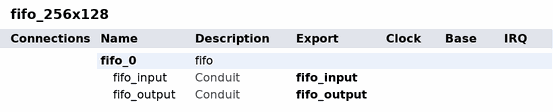
[diagram p0: system contents]
# Platform Designer (Qsys) system fifo_256x128, Arria 10 10AX115S2F45I1SG
# Parameters at their usual value, and those the tool derives, are not listed.
package require qsys
create_system fifo_256x128
set_project_property DEVICE_FAMILY {Arria 10}
set_project_property DEVICE 10AX115S2F45I1SG

add_instance fifo_0 fifo 16.1
set_instance_property fifo_0 AUTO_EXPORT true
set_instance_parameter_value fifo_0 GUI_AlmostEmpty false
set_instance_parameter_value fifo_0 GUI_AlmostEmptyThr 1
set_instance_parameter_value fifo_0 GUI_AlmostFull false
set_instance_parameter_value fifo_0 GUI_AlmostFullThr 1
set_instance_parameter_value fifo_0 GUI_CLOCKS_ARE_SYNCHRONIZED 0
set_instance_parameter_value fifo_0 GUI_Clock 4
set_instance_parameter_value fifo_0 GUI_DISABLE_DCFIFO_EMBEDDED_TIMING_CONSTRAINT true
set_instance_parameter_value fifo_0 GUI_Depth 256
set_instance_parameter_value fifo_0 GUI_ENABLE_ECC false
set_instance_parameter_value fifo_0 GUI_Empty true
set_instance_parameter_value fifo_0 GUI_Full true
set_instance_parameter_value fifo_0 GUI_LE_BasedFIFO false
set_instance_parameter_value fifo_0 GUI_LegacyRREQ 0
set_instance_parameter_value fifo_0 GUI_MAX_DEPTH Auto
set_instance_parameter_value fifo_0 GUI_MAX_DEPTH_BY_9 false
set_instance_parameter_value fifo_0 GUI_OVERFLOW_CHECKING false
set_instance_parameter_value fifo_0 GUI_Optimize 0
set_instance_parameter_value fifo_0 GUI_Optimize_max 0
set_instance_parameter_value fifo_0 GUI_RAM_BLOCK_TYPE Auto
set_instance_parameter_value fifo_0 GUI_UNDERFLOW_CHECKING false
set_instance_parameter_value fifo_0 GUI_UsedW true
set_instance_parameter_value fifo_0 GUI_Width 128
set_instance_parameter_value fifo_0 GUI_dc_aclr false
set_instance_parameter_value fifo_0 GUI_delaypipe 4
set_instance_parameter_value fifo_0 GUI_diff_widths true
set_instance_parameter_value fifo_0 GUI_msb_usedw false
set_instance_parameter_value fifo_0 GUI_output_width 512
set_instance_parameter_value fifo_0 GUI_read_aclr_synch false
set_instance_parameter_value fifo_0 GUI_rsEmpty true
set_instance_parameter_value fifo_0 GUI_rsFull false
set_instance_parameter_value fifo_0 GUI_rsUsedW true
set_instance_parameter_value fifo_0 GUI_sc_aclr false
set_instance_parameter_value fifo_0 GUI_sc_sclr false
set_instance_parameter_value fifo_0 GUI_synStage 3
set_instance_parameter_value fifo_0 GUI_write_aclr_synch false
set_instance_parameter_value fifo_0 GUI_wsEmpty false
set_instance_parameter_value fifo_0 GUI_wsFull true
set_instance_parameter_value fifo_0 GUI_wsUsedW true

# exported interfaces
add_interface fifo_input conduit end
set_interface_property fifo_input EXPORT_OF fifo_0.fifo_input
add_interface fifo_output conduit end
set_interface_property fifo_output EXPORT_OF fifo_0.fifo_output

set_interconnect_requirement {$system} qsys_mm.clockCrossingAdapter HANDSHAKE
set_interconnect_requirement {$system} qsys_mm.enableEccProtection FALSE
set_interconnect_requirement {$system} qsys_mm.insertDefaultSlave FALSE
set_interconnect_requirement {$system} qsys_mm.maxAdditionalLatency 1

save_system fifo_256x128.qsys
